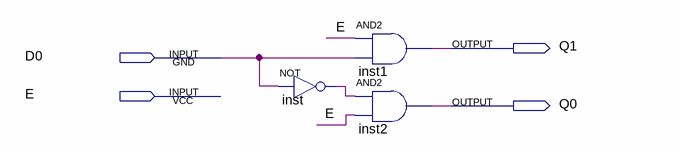
[diagram p0: schematic sheet]
// Quartus schematic DC2.bdf as structural Verilog: 3 symbols, 4 pins
module DC2 (
  input  D0,
  input  E,
  output Q1,
  output Q0
);

  wire inst_out;

  not inst (inst_out, D0);
  and inst1 (Q1, E, D0);
  and inst2 (Q0, inst_out, E);
endmodule
